# Altium schematic sheet logger_mcu_v2.SchDoc
size A
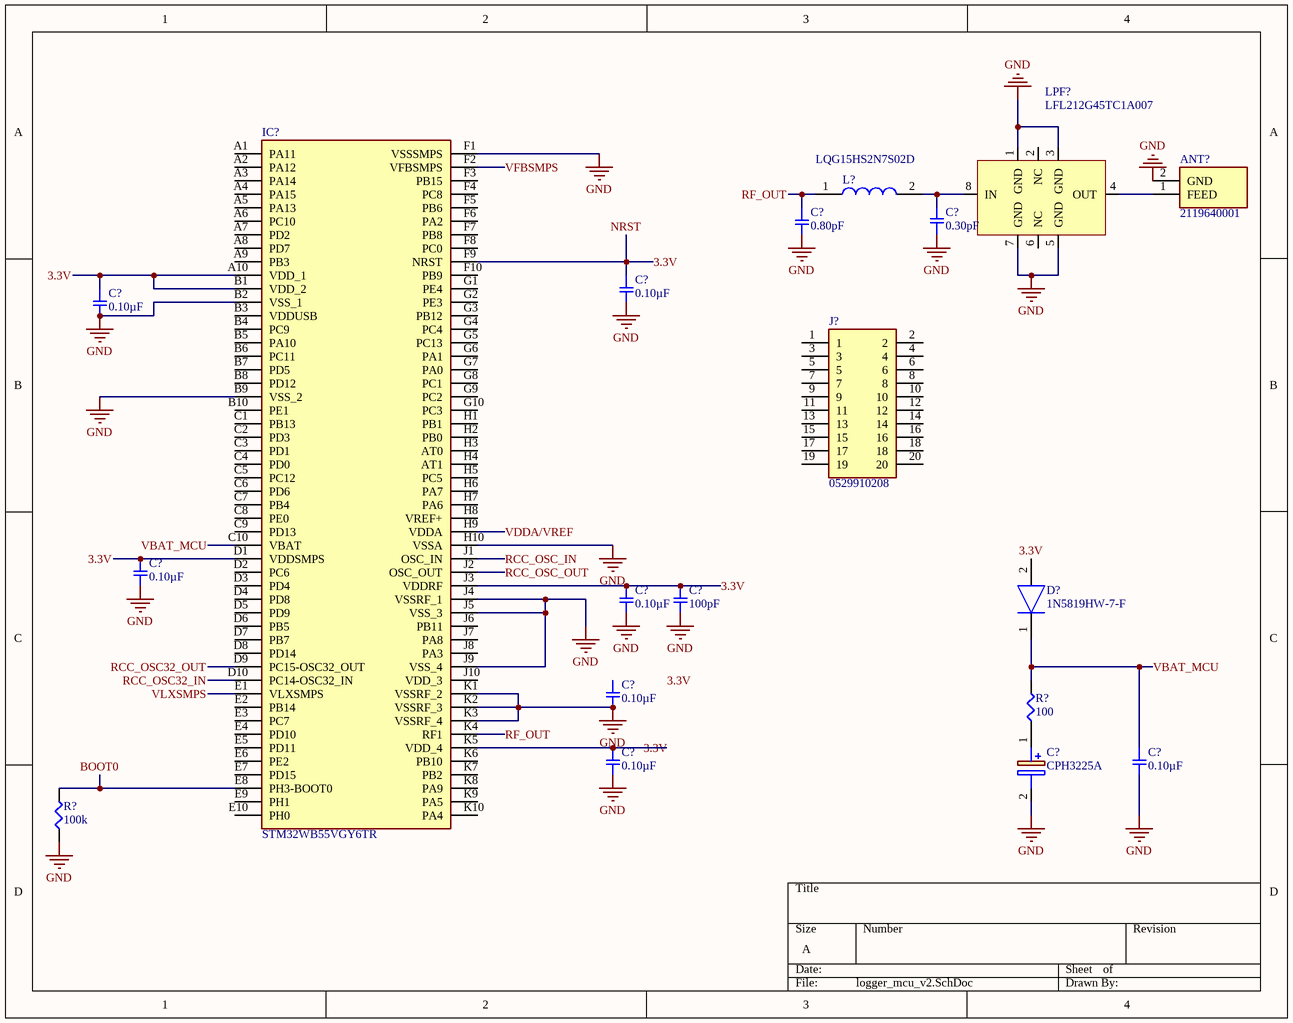
[diagram p0: logger_mcu_v2.SchDoc]

## Parts
(Parts that share a designator on the sheet are numbered #1, #2 ... from top to bottom, then left to right.)
ANT?  2119640001  [2119640001]
C?#1  0.80pF  [SMD-0402C]
C?#2  0.30pF  [SMD-0402C]
C?#3  0.10µF  [SMD-0402C]
C?#4  0.10µF  [SMD-0402C]
C?#5  0.10µF  [SMD-0402C]
C?#6  0.10µF  [SMD-0402C]
C?#7  100pF  [SMD-0402C]
C?#8  0.10µF  [SMD-0402C]
C?#9  CPH3225A  [CPH3225A]
C?#10  0.10µF  [SMD-0402C]
C?#11  0.10µF  [SMD-0402C]
D?  1N5819HW-7-F  [SOD3716X145N]
IC?  STM32WB55VGY6TR  [BGA100C40P10X10_440X438X59]
J?  0529910208  [0529910208]
L?  LQG15HS2N7S02D  [INDC1005X55N]
LPF?  LFL212G45TC1A007  [LFL212G45TC1A007]
R?#1  100  [SMD-0402-RES]
R?#2  100k  [SMD-0402-RES]

## Nets
GND: ANT?.2(GND) C?#1.2 C?#2.1 C?#3.2 C?#4.2 C?#5.2 C?#6.2 C?#7.2 C?#8.2 C?#9.2(-) C?#10.2 C?#11.2 IC?.B2(VSS_1) IC?.B9(VSS_2) IC?.F1(VSSSMPS) IC?.H10(VSSA) IC?.J4(VSSRF_1) IC?.J5(VSS_3) IC?.J9(VSS_4) IC?.K1(VSSRF_2) IC?.K2(VSSRF_3) IC?.K3(VSSRF_4) LPF?.1(GND) LPF?.3(GND) LPF?.5(GND) LPF?.7(GND) R?#2.1
3.3V: C?#3.1 C?#4.1 C?#5.1 C?#6.1 C?#7.1 C?#10.1 D?.2(A) IC?.A10(VDD_1) IC?.B1(VDD_2) IC?.D1(VDDSMPS) IC?.F9(NRST) IC?.J3(VDDRF) IC?.K5(VDD_4)  [also labelled NRST]
BOOT0: IC?.E8(PH3-BOOT0) R?#2.2
RCC_OSC32_IN: IC?.D10(PC14-OSC32_IN)
RCC_OSC32_OUT: IC?.D9(PC15-OSC32_OUT)
RCC_OSC_IN: IC?.J1(OSC_IN)
RCC_OSC_OUT: IC?.J2(OSC_OUT)
RF_OUT: C?#1.1 IC?.K4(RF1) L?.1
VBAT_MCU: C?#11.1 D?.1(K) IC?.C10(VBAT) R?#1.2
VDDA/VREF: IC?.H9(VDDA)
VFBSMPS: IC?.F2(VFBSMPS)
VLXSMPS: IC?.E1(VLXSMPS)
NetANT?_1: ANT?.1(FEED) LPF?.4(OUT)
NetC?#2_2: C?#2.2 L?.2 LPF?.8(IN)
NetC?#9_1: C?#9.1(+) R?#1.1

Not connected (* = marked no-connect by the designer): C?#8 1; IC? A1(PA11) A2(PA12) A3(PA14) A4(PA15) A5(PA13) A6(PC10) A7(PD2) A8(PD7) A9(PB3) B3(VDDUSB) B4(PC9) B5(PA10) B6(PC11) B7(PD5) B8(PD12) B10(PE1) C1(PB13) C2(PD3) C3(PD1) C4(PD0) C5(PC12) C6(PD6) C7(PB4) C8(PE0) C9(PD13) D2(PC6) D3(PD4) D4(PD8) D5(PD9) D6(PB5) D7(PB7) D8(PD14) E2(PB14) E3(PC7) E4(PD10) E5(PD11) E6(PE2) E7(PD15) E9(PH1) E10(PH0) F3(PB15) F4(PC8) F5(PB6) F6(PA2) F7(PB8) F8(PC0) F10(PB9) G1(PE4) G2(PE3) G3(PB12) G4(PC4) G5(PC13) G6(PA1) G7(PA0) G8(PC1) G9(PC2) G10(PC3) H1(PB1) H2(PB0) H3(AT0) H4(AT1) H5(PC5) H6(PA7) H7(PA6) H8(VREF+) J6(PB11) J7(PA8) J8(PA3) J10(VDD_3) K6(PB10) K7(PB2) K8(PA9) K9(PA5) K10(PA4); J? 1 2 3 4 5 6 7 8 9 10 11 12 13 14 15 16 17 18 19 20; LPF? 2(NC) 6(NC)

## Notes on the sheet
- Labels drawn without touching a wire or pin: 3.3V

## Library data of the parts
ANT? = 2119640001: Antenna; Manufacturer_Name: Molex; Datasheet Link: https://www.molex.com/pdm_docs/sd/2119640001_sd.pdf; Height: 1.2mm; Manufacturer_Part_Number: 2119640001; Mouser Part Number: N/A; Mouser Price/Stock: https://www.mouser.com/Search/Refine.aspx?Keyword=N%2FA
C?#1 = GRM1555C1HR80BA01D: CAP CER 0.8PF 50V NP0 0402; Manufacturer: Murata Electronics North America; Factory Stock: 0; Unit Price (USD): 0.1; Minimum Quantity: 1; Tolerance: ±0.1pF; Temperature Coefficient: C0G, NP0; Datasheets: http://www.murata.com/~/media/webrenewal/support/library/catalog/products/capacitor/mlcc/c02e.pdf; Image: //media.digikey.com/Renders/Murata%20Renders/ZRB-SERIES-0402.jpg; Digi-Key Part Number: 490-6269-1-ND; Part Number: GRM1555C1HR80BA01D; Quantity Available: 38847; @ qty: 0; Packaging: Cut Tape (CT); Series: GRM; Part Status: Active; Value: 0.80pF; Voltage: 50V; Operating Temperature: -55°C ~ 125°C; Features: -; Ratings: -; Applications: General Purpose; Mounting Type: Surface Mount, MLCC; Package / Case: 0402 (1005 Metric); Size / Dimension: 0.039" L x 0.020" W (1.00mm x 0.50mm); Height - Seated (Max): -; Thickness (Max): 0.022" (0.55mm); Lead Spacing: -; Lead Style: -
C?#2 = GRM1555C1HR30WA01D: CAP CER 0.3PF 50V NP0 0402; Manufacturer: Murata Electronics North America; Factory Stock: 0; Unit Price (USD): 0.16; Minimum Quantity: 1; Tolerance: ±0.05pF; Temperature Coefficient: C0G, NP0; Datasheets: http://www.murata.com/~/media/webrenewal/support/library/catalog/products/capacitor/mlcc/c02e.pdf; Image: //media.digikey.com/Renders/Murata%20Renders/ZRB-SERIES-0402.jpg; Digi-Key Part Number: 490-6261-1-ND; Part Number: GRM1555C1HR30WA01D; Quantity Available: 61475; @ qty: 0; Packaging: Cut Tape (CT); Series: GRM; Part Status: Active; Value: 0.30pF; Voltage: 50V; Operating Temperature: -55°C ~ 125°C; Features: -; Ratings: -; Applications: General Purpose; Mounting Type: Surface Mount, MLCC; Package / Case: 0402 (1005 Metric); Size / Dimension: 0.039" L x 0.020" W (1.00mm x 0.50mm); Height - Seated (Max): -; Thickness (Max): 0.022" (0.55mm); Lead Spacing: -; Lead Style: -
C?#3-C?#6 C?#8 C?#10 C?#11 = GCM155R71C104KA55D: CAP CER 0.1UF 16V X7R 0402; Manufacturer: Murata Electronics North America; Factory Stock: 0; Unit Price (USD): 0.1; Minimum Quantity: 1; Tolerance: ±10%; Datasheets: http://www.murata.com/~/media/webrenewal/support/library/catalog/products/capacitor/mlcc/c03e.ashx; Image: //media.digikey.com/Renders/Murata%20Renders/ZRB-SERIES-0402.jpg; Digi-Key Part Number: 490-4759-1-ND; Part Number: GCM155R71C104KA55D; Quantity Available: 734194; @ qty: 0; Packaging: Cut Tape (CT); Series: GCM; Part Status: Active; Value: 0.10µF; Voltage: 16V; Temperature Coefficient: X7R; Operating Temperature: -55°C ~ 125°C; Features: -; Ratings: AEC-Q200; Applications: Automotive; Mounting Type: Surface Mount, MLCC; Package / Case: 0402 (1005 Metric); Size / Dimension: 0.039" L x 0.020" W (1.00mm x 0.50mm); Height - Seated (Max): -; Thickness (Max): 0.022" (0.55mm); Lead Spacing: -; Lead Style: -
C?#7 = GCM1555C1H101JA16D: CAP CER 100PF 50V NP0 0402; Manufacturer: Murata Electronics North America; Factory Stock: 0; Unit Price (USD): 0.1; Minimum Quantity: 1; Tolerance: ±5%; Temperature Coefficient: C0G, NP0; Datasheets: http://www.murata.com/~/media/webrenewal/support/library/catalog/products/capacitor/mlcc/c03e.ashx; Image: //media.digikey.com/Renders/Murata%20Renders/ZRB-SERIES-0402.jpg; Digi-Key Part Number: 490-10669-1-ND; Part Number: GCM1555C1H101JA16D; Quantity Available: 61397; @ qty: 0; Packaging: Cut Tape (CT); Series: GCM; Part Status: Active; Value: 100pF; Voltage: 50V; Operating Temperature: -55°C ~ 125°C; Features: -; Ratings: AEC-Q200; Applications: Automotive; Mounting Type: Surface Mount, MLCC; Package / Case: 0402 (1005 Metric); Size / Dimension: 0.039" L x 0.020" W (1.00mm x 0.50mm); Height - Seated (Max): -; Thickness (Max): 0.022" (0.55mm); Lead Spacing: -; Lead Style: -
C?#9 = CPH3225A: Capacitor Polarised; Manufacturer_Name: Seiko Instruments Micro Energy; Datasheet Link: https://www.sii.co.jp/en/me/datasheets/chip-capacitor/cph3225a/; Height: 1mm; Manufacturer_Part_Number: CPH3225A; Mouser Part Number: 628-CPH3225A; Mouser Price/Stock: https://www.mouser.com/Search/Refine.aspx?Keyword=628-CPH3225A
D? = 1N5819HW-7-F: Diode; Manufacturer_Name: Diodes Inc.; Allied_Number: 70437201; Datasheet Link: http://www.diodes.com/_files/datasheets/ds30217.pdf; Height: 1.45mm; Manufacturer_Part_Number: 1N5819HW-7-F; Mouser Part Number: 621-1N5819HW-F; Mouser Price/Stock: https://www.mouser.com/Search/Refine.aspx?Keyword=621-1N5819HW-F; RS Part Number: 7082197P; RS Price/Stock: http://uk.rs-online.com/web/p/products/7082197P; Allied Price/Stock: http://www.alliedelec.com/diodes-inc-1n5819hw-7-f/70437201/
IC? = STM32WB55VGY6TR: Integrated Circuit; Manufacturer_Name: STMicroelectronics; Datasheet Link: https://www.st.com/resource/en/datasheet/stm32wb55vg.pdf; Height: 0.59mm; Manufacturer_Part_Number: STM32WB55VGY6TR; Mouser Part Number: 511-STM32WB55VGY6TR; Mouser Price/Stock: https://www.mouser.com/Search/Refine.aspx?Keyword=511-STM32WB55VGY6TR
J? = 0529910208: Connector; Manufacturer_Name: Molex; Datasheet Link: https://www.molex.com/pdm_docs/sd/529910208_sd.pdf; Height: 2.47mm; Manufacturer_Part_Number: 0529910208
L? = LQG15HS2N7S02D: Inductor; Manufacturer_Name: Murata Electronics; Datasheet Link: https://www.arrow.com/en/products/lqg15hs2n7s02d/murata-manufacturing; Height: 0.55mm; Manufacturer_Part_Number: LQG15HS2N7S02D
R?#1 = ERJ-2RKF1003X: RES SMD 100 OHM 5% 1/4W 0603; Manufacturer: Panasonic Electronic Components; Factory Stock: 0; Unit Price (USD): 0.00496; @ qty: 1500; Minimum Quantity: 1; Tolerance: ±1%; Power (Watts): 0.1W, 1/10W; Temperature Coefficient: ±100ppm/°C; Part Number: ERJ-2RKF1003X; Datasheets: http://industrial.panasonic.com/www-cgi/jvcr13pz.cgi?E+PZ+3+AOA0002+ERJ2RKF1003X+7+WW; Image: //media.digikey.com/Photos/Panasonic%20Photos/ERJ-PA2-Series.jpg; Digi-Key Part Number: P100KLCT-ND; Quantity Available: 2645965; Packaging: Cut Tape (CT); Series: ERJ; Part Status: Active; Value: 100; Composition: Thick Film; Features: Automotive AEC-Q200; Operating Temperature: -55°C ~ 155°C; Package / Case: 0603 (1608 Metric); Supplier Device Package: 0603; Size / Dimension: 0.039" L x 0.020" W (1.00mm x 0.50mm); Height - Seated (Max): 0.016" (0.40mm); Number of Terminations: 2; Failure Rate: -
R?#2 = ERJ-2RKF1003X: RES SMD 100K OHM 1% 1/10W 0402; Manufacturer: Panasonic Electronic Components; Factory Stock: 0; Unit Price (USD): 0.00496; @ qty: 1500; Minimum Quantity: 1; Power (Watts): 0.1W, 1/10W; Temperature Coefficient: ±100ppm/°C; Part Number: ERJ-2RKF1003X; Datasheets: http://industrial.panasonic.com/www-cgi/jvcr13pz.cgi?E+PZ+3+AOA0002+ERJ2RKF1003X+7+WW; Image: //media.digikey.com/Photos/Panasonic%20Photos/ERJ-PA2-Series.jpg; Digi-Key Part Number: P100KLCT-ND; Quantity Available: 2645965; Packaging: Cut Tape (CT); Series: ERJ; Part Status: Active; Value: 100k; Tolerance: ±1%; Composition: Thick Film; Features: Automotive AEC-Q200; Operating Temperature: -55°C ~ 155°C; Package / Case: 0402 (1005 Metric); Supplier Device Package: 0402; Size / Dimension: 0.039" L x 0.020" W (1.00mm x 0.50mm); Height - Seated (Max): 0.016" (0.40mm); Number of Terminations: 2; Failure Rate: -